# EAGLE design tophat (EAGLE 9.6.2)
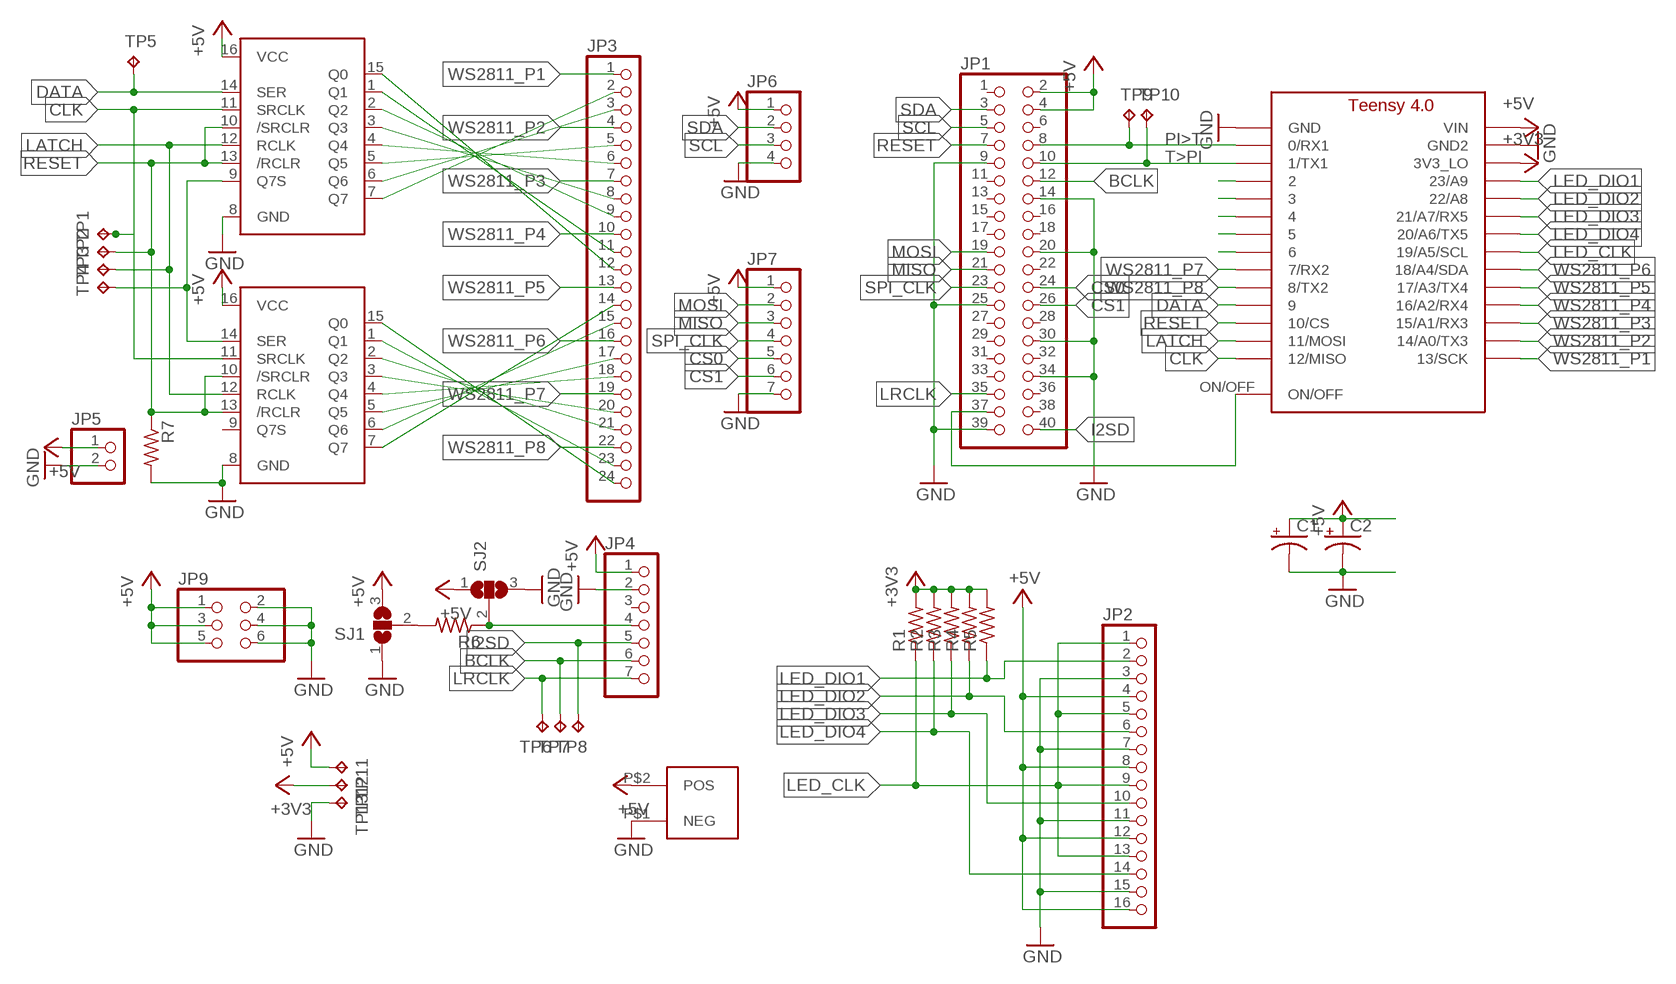
[diagram p0: schematic, sheet 1]

## Parts
C1  CPOL-USE5-10.5  [E5-10,5]
C2  CPOL-USE5-10.5  [E5-10,5]
JP1  PINHD-2X20  [2X20]
JP2  PINHD-1X16/90  [1X16/90]
JP3  PINHD-1X24/90  [1X24/90]
JP4  PINHD-1X7  [1X07]
JP5  PINHD-1X2  [1X02]
JP6  PINHD-1X4  [1X04]
JP7  PINHD-1X7  [1X07]
JP8  PWR_CONN  [PWR_CONN]
JP9  PINHD-2X3  [2X03]
R1  R-US_0207/10  [0207/10]
R2  R-US_0207/10  [0207/10]
R3  R-US_0207/10  [0207/10]
R4  R-US_0207/10  [0207/10]
R5  R-US_0207/10  [0207/10]
R6  R-US_0207/10  [0207/10]
R7  R-US_0207/10  [0207/10]
SJ1  SJ2W  [SJ_2]
SJ2  SJ2W  [SJ_2]
TP1  TPB2,54  [B2,54]
TP2  TPB2,54  [B2,54]
TP3  TPB2,54  [B2,54]
TP4  TPB2,54  [B2,54]
TP5  TPB2,54  [B2,54]
TP6  TPB2,54  [B2,54]
TP7  TPB2,54  [B2,54]
TP8  TPB2,54  [B2,54]
TP9  TPB2,54  [B2,54]
TP10  TPB2,54  [B2,54]
TP11  TPB2,54  [B2,54]
TP12  TPB2,54  [B2,54]
TP13  TPB2,54  [B2,54]
U$1  TEENSY_4.0  [TEENSY_4.0]
U$2  74AHCT95  [SOIC127P600X175-16N]
U$3  74AHCT95  [SOIC127P600X175-16N]

## Nets
+3V3: R1.2 R2.2 R3.2 R4.2 R5.2 TP12.TP U$1.3V3_LO
+5V: C1.+ C2.+ JP1.2 JP1.4 JP2.4 JP2.8 JP2.12 JP2.16 JP4.1 JP5.1 JP6.1 JP7.1 JP8.P$2(POS) JP9.1 JP9.3 JP9.5 SJ1.3 SJ2.1 TP11.TP U$1.VIN U$2.16(VCC) U$3.16(VCC)
BCLK: JP1.12 JP4.6 TP7.TP
CLK: TP1.TP U$1.12/MISO U$2.11(SRCLK) U$3.11(SRCLK)
CS0: JP1.24 JP7.5
CS1: JP1.26 JP7.6
DATA: TP5.TP U$1.9/CS U$2.14(SER)
GND: C1.- C2.- JP1.9 JP1.14 JP1.20 JP1.25 JP1.30 JP1.34 JP1.39 JP2.3 JP2.7 JP2.11 JP2.15 JP4.2 JP5.2 JP6.4 JP7.7 JP8.P$1(NEG) JP9.2 JP9.4 JP9.6 R7.2 SJ1.1 SJ2.3 TP13.TP U$1.GND U$1.GND2 U$2.8(GND) U$3.8(GND)
I2SD: JP1.40 JP4.5 TP8.TP
LATCH: TP3.TP U$1.11/MOSI U$2.12(RCLK) U$3.12(RCLK)
LED_CLK: JP2.1 JP2.5 JP2.9 JP2.13 R1.1 U$1.19/A5/SCL
LED_DIO1: JP2.2 R5.1 U$1.23/A9
LED_DIO2: JP2.6 R4.1 U$1.22/A8
LED_DIO3: JP2.10 R3.1 U$1.21/A7(21/A7/RX5)
LED_DIO4: JP2.14 R2.1 U$1.20/A6(20/A6/TX5)
LRCLK: JP1.35 JP4.7 TP6.TP
MISO: JP1.21 JP7.3
MOSI: JP1.19 JP7.2
N$1: TP4.TP U$2.9(Q7S) U$3.14(SER)
N$2: JP1.37 U$1.ON/OFF
N$4: JP3.2 U$2.7(Q7)
N$5: JP3.3 U$2.6(Q6)
N$6: JP3.5 U$2.5(Q5)
N$7: JP3.6 U$2.4(Q4)
N$8: JP3.8 U$2.3(Q3)
N$9: JP3.9 U$2.2(Q2)
N$10: JP3.11 U$2.1(Q1)
N$11: JP3.12 U$2.15(Q0)
N$12: JP3.14 U$3.7(Q7)
N$13: JP3.15 U$3.6(Q6)
N$14: JP3.17 U$3.5(Q5)
N$15: JP3.18 U$3.4(Q4)
N$16: JP3.20 U$3.3(Q3)
N$17: JP3.21 U$3.2(Q2)
N$18: JP3.23 U$3.1(Q1)
N$19: JP3.24 U$3.15(Q0)
N$20: JP4.4 R6.1 SJ2.2
N$21: R6.2 SJ1.2
N$28: U$1.6
N$29: U$1.5
N$30: U$1.4/CANRX
N$31: U$1.3/CANTX
N$32: U$1.2
PI>T: JP1.8 TP9.TP U$1.0/RX(0/RX1)
RESET: JP1.7 R7.1 TP2.TP U$1.10/CS U$2.10(/SRCLR) U$2.13(/RCLR) U$3.10(/SRCLR) U$3.13(/RCLR)
SCL: JP1.5 JP6.3
SDA: JP1.3 JP6.2
SPI_CLK: JP1.23 JP7.4
T>PI: JP1.10 TP10.TP U$1.1/TX(1/TX1)
WS2811_P1: JP3.1 U$1.13/SCK
WS2811_P2: JP3.4 U$1.14/A0(14/A0/TX3)
WS2811_P3: JP3.7 U$1.15/A1(15/A1/RX3)
WS2811_P4: JP3.10 U$1.16/A2(16/A2/RX4)
WS2811_P5: JP3.13 U$1.17/A3(17/A3/TX4)
WS2811_P6: JP3.16 U$1.18/A4/SDA
WS2811_P7: JP3.19 U$1.7(7/RX2)
WS2811_P8: JP3.22 U$1.8(8/TX2)
Unconnected: JP1.1 JP1.6 JP1.11 JP1.13 JP1.15 JP1.16 JP1.17 JP1.18 JP1.22 JP1.27 JP1.28 JP1.29 JP1.31 JP1.32 JP1.33 JP1.36 JP1.38 JP4.3 U$3.9(Q7S)

## Library data of the parts
C1 C2 = rcl:CPOL-US: POLARIZED CAPACITOR, American symbol; SPICEPREFIX: C
JP1 = pinhead:PINHD-2X20: PIN HEADER
JP2 = pinhead:PINHD-1X16: PIN HEADER
JP3 = pinhead:PINHD-1X24: PIN HEADER
JP4 JP7 = pinhead:PINHD-1X7: PIN HEADER
JP5 = pinhead:PINHD-1X2: PIN HEADER
JP6 = pinhead:PINHD-1X4: PIN HEADER
JP8 = railbaron:PWR_CONN
JP9 = pinhead:PINHD-2X3: PIN HEADER
R1-R7 = rcl:R-US_: RESISTOR, American symbol; SPICEPREFIX: R
SJ1 SJ2 = jumper:SJ2W: SMD solder JUMPER
TP1-TP13 = testpad:TP: Test pad
U$1 = railbaron:TEENSY_4.0
U$2 U$3 = railbaron:74AHCT95

## Board
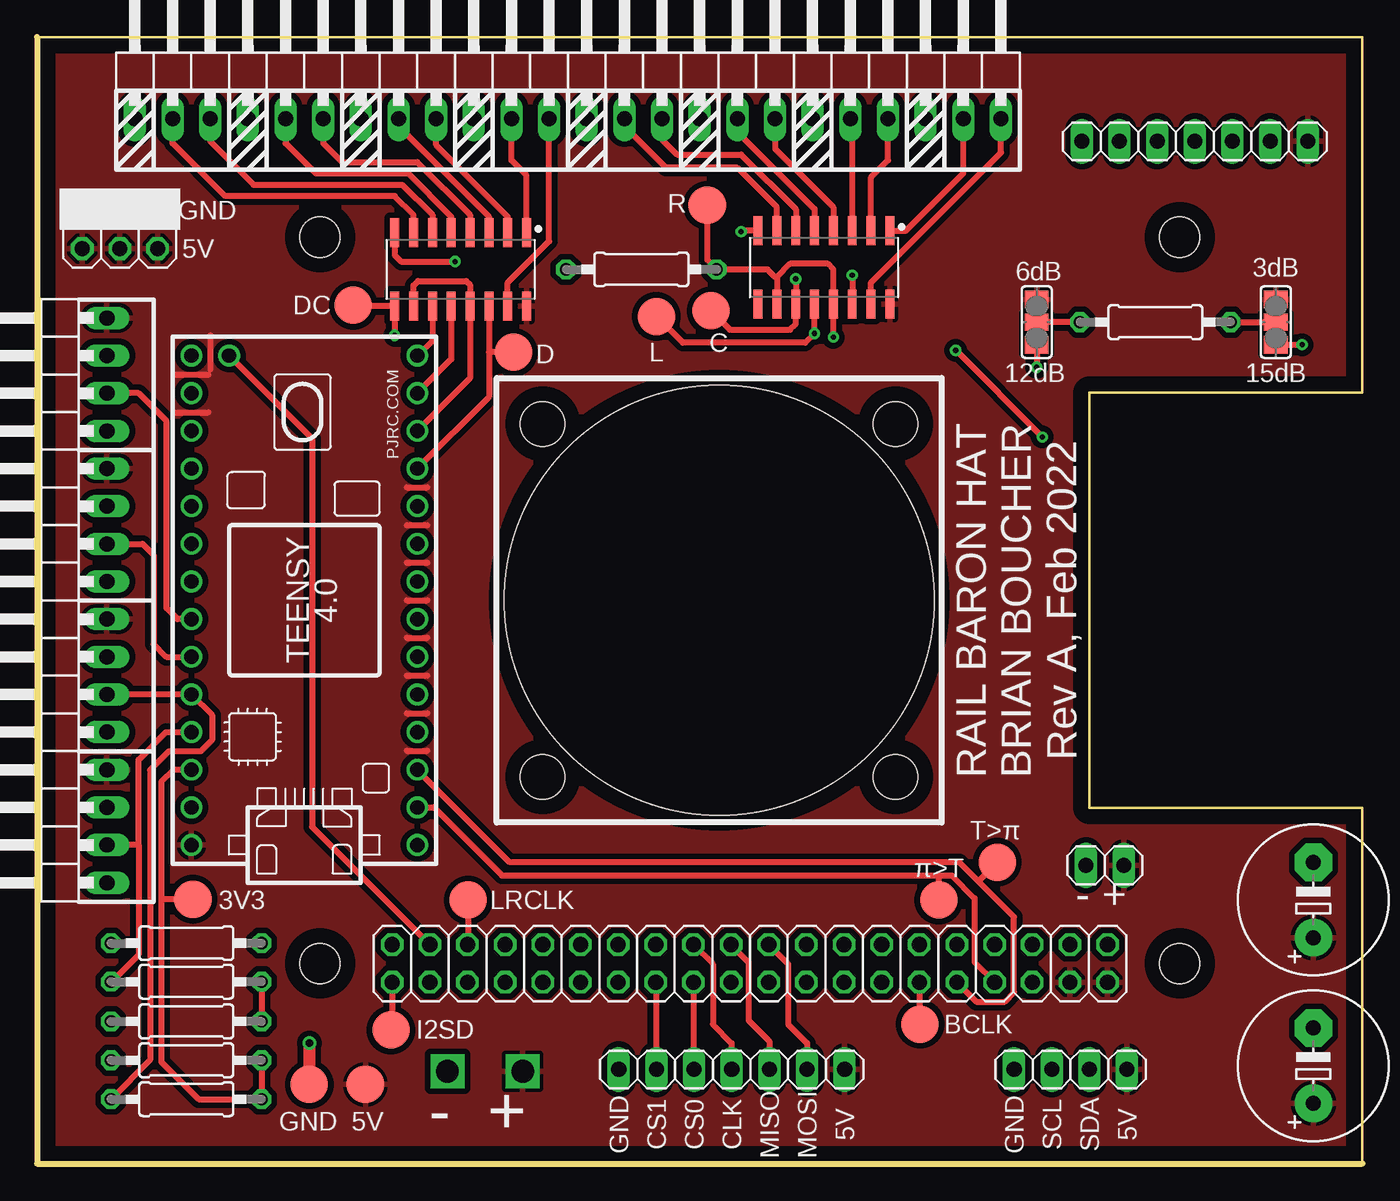
[diagram p1: board, top side]
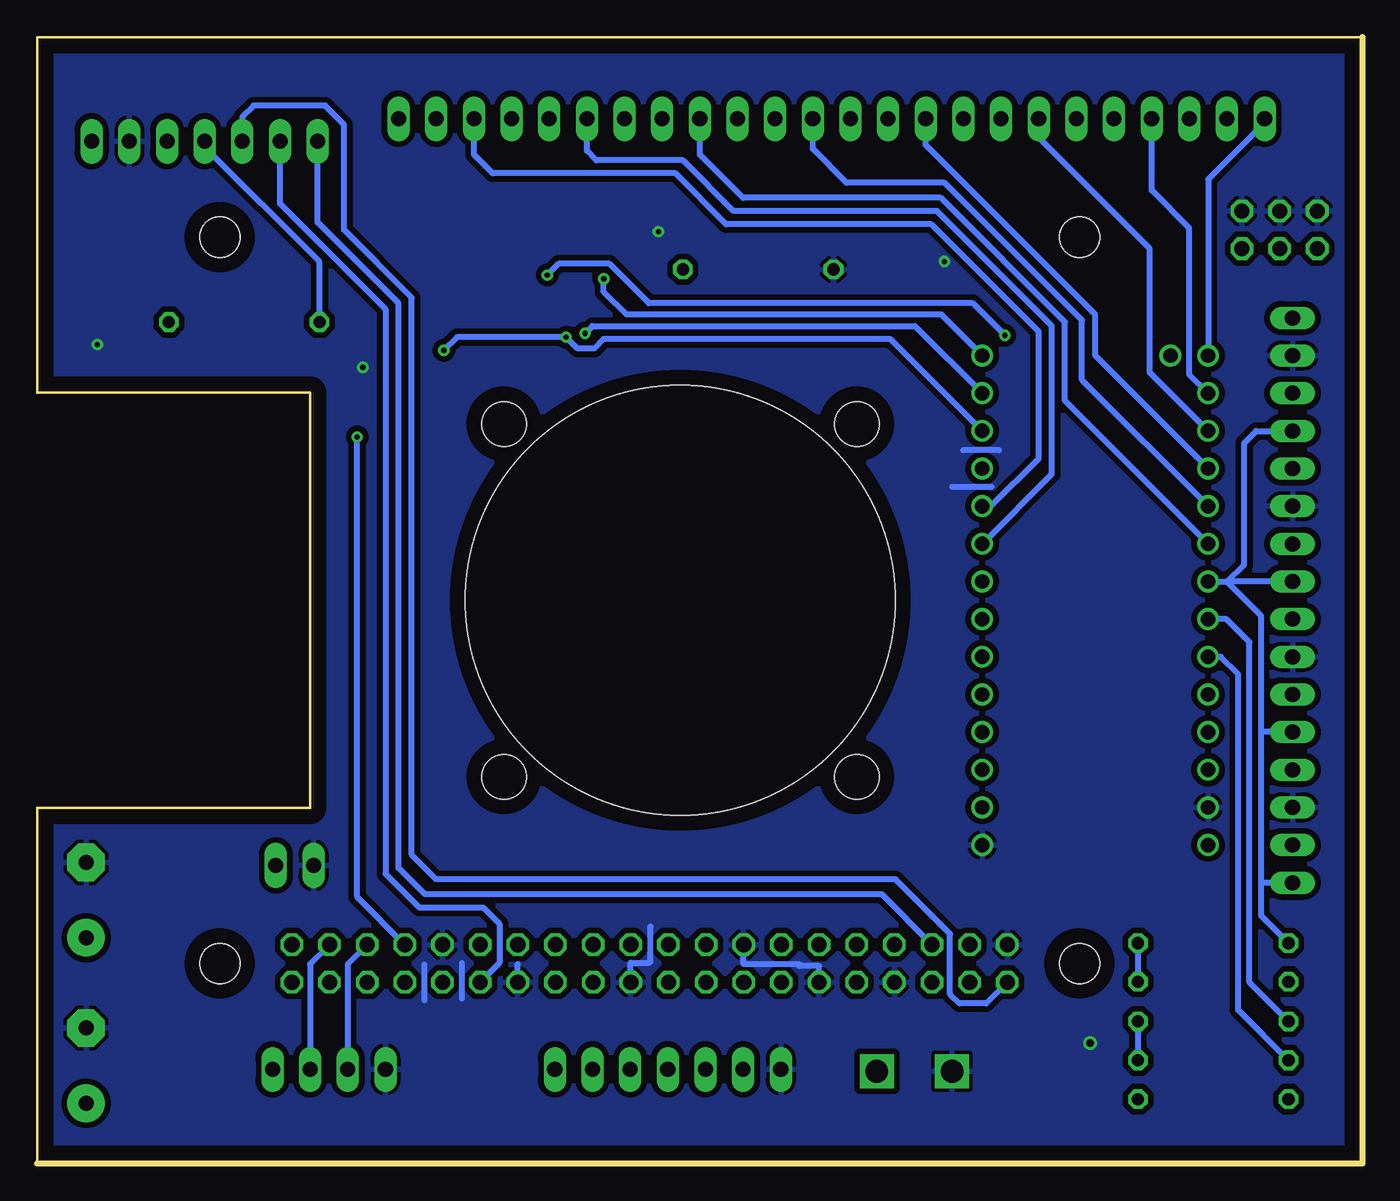
[diagram p2: board, bottom side, seen from below]

Size 89.41 x 76 mm. Coordinates in mm from the lower left corner, seen from the top.
Outline: 0,0 89.41,0 89.41,24 71,24 71,52 89.41,52 89.41,76 0,76 0,0
Copper layers (1*16): Top 0.035mm / dielectric 1.5mm / Bottom 0.035mm
Design rules "default *": minimum track width 6mil, minimum drill 0.35mm, track to track 6mil, track to pad 6mil, pad to pad 6mil, via to via 6mil, smd to smd 6mil, copper to edge 40mil, drill to drill 6mil, minimum pad ring 10mil, minimum via ring 8mil, stop-mask expansion 4mil, vias tented up to drill 20mil, thermal gap 10mil
Holes 2.7 mm at 19.09,13.5 77.09,13.5 77.09,62.5 19.09,62.5
Holes 3 mm at 34.12,26.1 57.92,26.1 57.92,49.9 34.12,49.9
Holes 29 mm at 46.02,38

### Footprints (pad centres in the part's own frame; a part is rotated, then mirrored left to right if it is on the bottom)
E5-10,5 = drill 1.016 pad 2.54: + -2.54,0 | drill 1.016 pad 2.54 octagon: - 2.54,0
2X20 = drill 1.016 octagon: 1 -24.13,-1.27; 2 -24.13,1.27; 3 -21.59,-1.27; 4 -21.59,1.27; 5 -19.05,-1.27; 6 -19.05,1.27; 7 -16.51,-1.27; 8 -16.51,1.27; 9 -13.97,-1.27; 10 -13.97,1.27; 11 -11.43,-1.27; 12 -11.43,1.27; 13 -8.89,-1.27; 14 -8.89,1.27; 15 -6.35,-1.27; 16 -6.35,1.27; 17 -3.81,-1.27; 18 -3.81,1.27; 19 -1.27,-1.27; 20 -1.27,1.27; 21 1.27,-1.27; 22 1.27,1.27; 23 3.81,-1.27; 24 3.81,1.27; 25 6.35,-1.27; 26 6.35,1.27; 27 8.89,-1.27; 28 8.89,1.27; 29 11.43,-1.27; 30 11.43,1.27; 31 13.97,-1.27; 32 13.97,1.27; 33 16.51,-1.27; 34 16.51,1.27; 35 19.05,-1.27; 36 19.05,1.27; 37 21.59,-1.27; 38 21.59,1.27; 39 24.13,-1.27; 40 24.13,1.27
1X16/90 = drill 1.016 long: 1 -19.05,-3.81; 2 -16.51,-3.81; 3 -13.97,-3.81; 4 -11.43,-3.81; 5 -8.89,-3.81; 6 -6.35,-3.81; 7 -3.81,-3.81; 8 -1.27,-3.81; 9 1.27,-3.81; 10 3.81,-3.81; 11 6.35,-3.81; 12 8.89,-3.81; 13 11.43,-3.81; 14 13.97,-3.81; 15 16.51,-3.81; 16 19.05,-3.81
1X24/90 = drill 1.016 long: 1 -29.21,-3.81; 2 -26.67,-3.81; 3 -24.13,-3.81; 4 -21.59,-3.81; 5 -19.05,-3.81; 6 -16.51,-3.81; 7 -13.97,-3.81; 8 -11.43,-3.81; 9 -8.89,-3.81; 10 -6.35,-3.81; 11 -3.81,-3.81; 12 -1.27,-3.81; 13 1.27,-3.81; 14 3.81,-3.81; 15 6.35,-3.81; 16 8.89,-3.81; 17 11.43,-3.81; 18 13.97,-3.81; 19 16.51,-3.81; 20 19.05,-3.81; 21 21.59,-3.81; 22 24.13,-3.81; 23 26.67,-3.81; 24 29.21,-3.81
1X07 = drill 1.016 long: 1 -7.62,0; 2 -5.08,0; 3 -2.54,0; 4 0,0; 5 2.54,0; 6 5.08,0; 7 7.62,0
1X02 = drill 1.016 long: 1 -1.27,0; 2 1.27,0
1X04 = drill 1.016 long: 1 -3.81,0; 2 -1.27,0; 3 1.27,0; 4 3.81,0
PWR_CONN = drill 1.524 square: P$1 -2.54,0; P$2 2.54,0
2X03 = drill 1.016 octagon: 1 -2.54,-1.27; 2 -2.54,1.27; 3 0,-1.27; 4 0,1.27; 5 2.54,-1.27; 6 2.54,1.27
0207/10 = drill 0.813 octagon: 1 -5.08,0; 2 5.08,0
SJ_2 = smd 1.168 x 1.6: 1 -1.524,0; 2 0,0; 3 1.524,0
B2,54 = smd 2.54 x 2.54: TP 0,0
TEENSY_4.0 = drill 0.965: 0/RX -13.97,-7.62; 1/TX -11.43,-7.62; 2 -8.89,-7.62; 3/CANTX -6.35,-7.62; 3V3_LO -11.43,7.62; 4/CANRX -3.81,-7.62; 5 -1.27,-7.62; 6 1.27,-7.62; 7 3.81,-7.62; 8 6.35,-7.62; 9/CS 8.89,-7.62; 10/CS 11.43,-7.62; 11/MOSI 13.97,-7.62; 12/MISO 16.51,-7.62; 13/SCK 16.51,7.62; 14/A0 13.97,7.62; 15/A1 11.43,7.62; 16/A2 8.89,7.62; 17/A3 6.35,7.62; 18/A4/SDA 3.81,7.62; 19/A5/SCL 1.27,7.62; 20/A6 -1.27,7.62; 21/A7 -3.81,7.62; 22/A8 -6.35,7.62; 23/A9 -8.89,7.62; GND -16.51,-7.62; GND2 -13.97,7.62; ON/OFF 16.51,5.08; VIN -16.51,7.62
SOIC127P600X175-16N = smd 1.965 x 0.602: 1 -2.475,4.445; 2 -2.475,3.175; 3 -2.475,1.905; 4 -2.475,0.635; 5 -2.475,-0.635; 6 -2.475,-1.905; 7 -2.475,-3.175; 8 -2.475,-4.445; 9 2.475,-4.445; 10 2.475,-3.175; 11 2.475,-1.905; 12 2.475,-0.635; 13 2.475,0.635; 14 2.475,1.905; 15 2.475,3.175; 16 2.475,4.445

### Placement (x,y rotation side)
C1  86.11,17.78 90 top
C2  86.11,6.6 90 top
JP1  48.09,13.5 180 top
JP2  0.91,38 90 top
JP3  35.81,74.3 0 top
JP4  78.11,68.96 180 top
JP5  72.03,20.12 180 top
JP6  69.72,6.35 180 top
JP7  46.86,6.35 180 top
JP8  30.23,6.22 0 top
JP9  5.59,62.99 0 top
R1  10.07,14.87 0 top
R2  10.07,9.59 0 top
R3  10.07,6.97 0 top
R4  10.07,4.35 0 top
R5  10.07,12.27 0 top
R6  75.44,56.77 0 top
R7  40.77,60.33 180 top
SJ1  83.57,56.77 90 top
SJ2  67.44,56.77 270 top
TP1  45.47,57.53 0 top
TP2  45.21,64.64 0 top
TP3  41.78,57.15 0 top
TP4  21.34,57.91 0 top
TP5  32.13,54.74 0 top
TP6  29.08,17.78 0 top
TP7  59.56,9.4 0 top
TP8  23.88,9.02 0 top
TP9  60.83,17.78 0 top
TP10  64.77,20.32 0 top
TP11  22.15,5.33 0 top
TP12  10.52,17.83 0 top
TP13  18.36,5.33 0 top
U$1  18.03,38 90 top
U$2  28.57,60.33 270 top
U$3  53.09,60.45 270 top

### Tracks (layer width: path | path; a pad name or v marks a point on that pad's centre or on a via)
+3V3
  Top 0.406: U$1.3V3_LO 9.17,26.57 8.38,25.78 8.38,17.83 | R5.2 R2.2 | R3.2 R4.2 10.89,4.35 8.38,6.86 8.38,17.83 | TP12.TP 8.38,17.83
  Bottom 0.406: R1.2 R5.2 | R2.2 R3.2
+5V
  Top 0.406: 24.94,45.62 26.31,45.62 | 24.94,43.08 26.31,43.08 | 24.94,40.54 26.31,40.54 | 24.94,38 26.31,38 | 24.94,35.46 26.31,35.46 | 24.94,32.92 26.31,32.92 | 24.94,30.38 26.31,30.38 | 24.94,27.84 26.31,27.84 | 11.68,55.88 11.68,53.59 | 9.27,53.21 11.56,53.21 | 9.27,50.67 11.56,50.67
  pour Top (isolate 0.381): -5,76 89.41,76 89.41,0 -5,0
BCLK
  Top 0.406: JP1.12 59.52,9.44 TP7.TP
  Bottom 0.406: JP4.6 73.03,64.77 65.91,57.66 65.91,19.56 63.63,17.27 59.31,17.27 58.22,16.18 58.22,13.53 JP1.12
CLK  (via drill 0.35)
  Top 0.406: U$2.11 26.67,55.53 U$1.12/MISO | v51.18,59.69 U$3.11 51.18,56.64 50.8,56.26 46.74,56.26 TP1.TP
  Bottom 0.406: U$1.12/MISO 28.42,57.28 49.66,57.28 51.18,58.8 v51.18,59.69
CS0
  Top 0.406: JP1.24 44.28,6.39 JP7.5
CS1
  Top 0.406: JP1.26 41.74,6.39 JP7.6
DATA
  Top 0.406: U$2.14 30.48,54.74 | 30.48,54.74 30.48,51.72 U$1.9/CS | TP5.TP 30.48,54.74
GND  (via drill 0.35, 0.5)
  Top 0.406: U$3.8 47.56,62.93 v47.5,62.87 | U$2.8 24.13,61.28 24.55,60.86 v28.19,60.86 | SJ1.1 v85.34,55.24 | SJ2.3 v67.44,53.72
  Top 0.813: v18.36,8.13 TP13.TP
  Bottom 0.406: JP1.30 36.66,13.34 37.98,13.34 37.98,13.45 41.74,13.45 JP1.25 | JP1.20 49.36,13.55 48.14,13.55 48.14,13.59 48.04,13.59 48.04,15.99 48.01,15.99 48.01,16 | JP1.14 56.98,13.46 | 24.51,48.13 26.92,48.13 | 25.02,45.64 27.69,45.64 | 60.76,13.51 60.76,11.12 | 63.3,13.41 63.3,11.02
  pour Bottom (isolate 0.381): -5,76 89.41,76 89.41,0 -5,0
I2SD
  Top 0.406: JP1.40 23.96,9.1 TP8.TP
  Bottom 0.406: JP1.40 25.4,10.79 27.18,10.79 27.81,11.43 27.81,15.49 31.5,19.18 62.48,19.18 64.14,20.83 64.14,58.42 68.71,62.99 68.71,70.1 69.98,71.37 74.8,71.37 75.56,70.61 JP4.5
LATCH  (via drill 0.35)
  Top 0.406: U$2.12 27.94,54.26 U$1.11/MOSI | U$3.12 v52.45,56.01 51.82,55.37 43.56,55.37 TP3.TP
  Bottom 0.406: U$1.11/MOSI 30.2,56.52 51.94,56.52 v52.45,56.01
LED_CLK
  Bottom 0.406: 9.1,39.27 U$1.19/A5/SCL 9.15,39.27 6.85,36.97 6.85,29.11 | 9.1,39.27 7.99,40.39 7.99,48.61 7.16,49.43 JP2.13 | 6.85,29.11 6.85,18.9 | 6.85,18.9 6.85,16.76 4.99,14.89 R1.1 | JP2.9 9.1,39.27 | JP2.5 6.85,29.11 | JP2.1 6.8,18.95 6.85,18.9
LED_DIO1
  Top 0.406: U$1.23/A9 8.71,29.11 6.84,27.24 6.84,21.54 | R5.1 5.03,12.27 6.84,14.08 6.84,21.54 | JP2.2 4.76,21.54 6.84,21.54
LED_DIO2
  Top 0.406: R4.1 7.62,6.99 7.62,26.54 8.89,27.81 11.05,27.81 11.81,28.57 11.81,30.25 U$1.22/A8 JP2.6
LED_DIO3
  Top 0.406: U$1.21/A7 8.72,34.19 7.86,35.05 7.86,41.06 7.11,41.81 JP2.10
  Bottom 0.406: R3.1 8.38,10.36 8.38,33.02 9.55,34.19 U$1.21/A7
LED_DIO4
  Top 0.406: U$1.20/A6 9.48,36.73 8.74,37.47 8.74,50.09 6.86,51.97 JP2.14
  Bottom 0.406: R2.1 7.62,12.22 7.62,35.18 9.17,36.73 U$1.20/A6
LRCLK
  Top 0.406: TP6.TP 29.08,14.81 JP1.35
  Bottom 0.406: JP1.35 32.43,18.16 63.25,18.16 65.02,19.94 65.02,58.04 70.48,63.5 JP4.7
MISO
  Top 0.406: JP1.21 48.01,13.58 48.01,9.65 49.4,8.26 JP7.3
MOSI
  Top 0.406: JP1.19 50.67,13.46 50.67,9.4 51.94,8.13 JP7.2
N$1  (via drill 0.35)
  Top 0.406: v24.13,55.88 U$2.9 21.4,57.85 TP4.TP | v54.99,59.94 U$3.14
  Bottom 0.406: v24.13,55.88 26.29,58.04 48.13,58.04 50.8,60.71 54.23,60.71 v54.99,59.94
N$2
  Top 0.406: U$1.ON/OFF 18.54,48.92 18.54,22.73 JP1.37
N$4
  Top 0.406: U$2.7 25.4,64.01 24.13,65.28 12.7,65.28 9.14,68.83 JP3.2
N$5
  Top 0.406: JP3.3 11.68,68.96 14.61,66.04 24.64,66.04 26.67,64.01 U$2.6
N$6
  Top 0.406: JP3.5 16.76,68.83 18.8,66.8 25.02,66.8 27.94,63.88 U$2.5
N$7
  Top 0.406: JP3.6 19.3,68.83 20.57,67.56 25.65,67.56 29.21,64.01 U$2.4
N$8
  Top 0.406: JP3.8 24.38,69.98 30.48,63.88 U$2.3
N$9
  Top 0.406: U$2.2 31.75,63.88 26.92,68.71 JP3.9
N$10
  Top 0.406: U$2.1 33.02,66.67 32,67.69 JP3.11
N$11
  Top 0.406: U$2.15 31.75,59.44 34.54,62.23 JP3.12
N$12
  Top 0.406: U$3.7 49.91,64.52 47.24,67.18 42.42,67.18 39.62,69.98 JP3.14
N$13
  Top 0.406: JP3.15 42.16,69.09 43.18,68.07 47.5,68.07 51.18,64.39 U$3.6
N$14
  Top 0.406: JP3.17 47.24,69.6 52.45,64.39 U$3.5
N$15
  Top 0.406: JP3.18 49.78,68.45 53.72,64.52 U$3.4
N$16
  Top 0.406: U$3.3 54.99,70.36 JP3.20
N$17
  Top 0.406: U$3.2 56.26,66.55 57.4,67.69 JP3.21
N$18
  Top 0.406: JP3.23 62.48,66.8 58.61,62.93 U$3.1
N$19
  Top 0.406: U$3.15 56.26,59.44 65.02,68.2 JP3.24
N$20
  Top 0.406: R6.1 SJ2.2
  Bottom 0.406: R6.1 70.36,60.83 78.11,68.58 JP4.4
N$21
  Top 0.406: R6.2 SJ1.2
PI>T
  Top 0.406: U$1.0/RX 26.77,24.03 31.37,19.43 60.83,19.43 | 60.83,19.43 61.72,19.43 63.25,17.91 63.25,13.58 JP1.8 | TP9.TP 60.83,19.43
RESET  (via drill 0.35)
  Top 0.406: U$1.10/CS 29.21,52.99 U$2.13 29.21,59.28 28.96,59.54 25.7,59.54 25.4,59.23 U$2.10 | 49.91,59.82 50.8,60.71 53.34,60.71 53.72,60.33 U$3.13 v53.72,55.75 | 49.91,59.82 U$3.10 | 49.91,59.82 49.78,59.82 49.28,60.33 R7.1 45.21,60.96 TP2.TP | v61.98,54.86 v67.82,49.02
  Bottom 0.406: U$1.10/CS 31.85,55.63 51.18,55.63 51.82,54.99 52.96,54.99 v53.72,55.75 61.09,55.75 v61.98,54.86 | JP1.7 67.82,17.99 v67.82,49.02
SCL
  Bottom 0.406: JP1.5 68.45,13.46 JP6.3
SDA
  Bottom 0.406: JP1.3 70.99,13.46 JP6.2
SPI_CLK
  Top 0.406: JP1.23 45.59,13.46 45.59,9.4 46.86,8.13 JP7.4
T>PI
  Top 0.406: JP1.10 63.37,10.92 65.28,10.92 65.91,11.56 65.91,16.64 63.5,19.05 | 63.5,19.05 62.23,20.32 31.88,20.32 25.65,26.55 U$1.1/TX | TP10.TP 63.5,19.05
WS2811_P1
  Bottom 0.406: JP3.1 6.6,70.21 10.41,66.4 U$1.13/SCK
WS2811_P2
  Bottom 0.406: U$1.14/A0 11.68,53.24 11.68,63.12 14.22,65.66 JP3.4
WS2811_P3
  Bottom 0.406: U$1.15/A1 14.35,53.37 14.35,61.72 21.84,69.22 JP3.7
WS2811_P4
  Bottom 0.406: U$1.16/A2 18.03,54.51 18.03,57.28 29.46,68.71 JP3.10
WS2811_P5
  Bottom 0.406: U$1.17/A3 18.92,52.86 18.92,56.9 28.19,66.17 34.8,66.17 37.08,68.45 JP3.13
WS2811_P6
  Bottom 0.406: U$1.18/A4/SDA 20.07,51.46 20.07,56.77 28.45,65.15 41.78,65.15 44.7,68.07 JP3.16
WS2811_P7
  Bottom 0.406: JP3.19 52.32,68.33 51.69,67.69 45.85,67.69 42.42,64.26 28.7,64.26 20.95,56.52 20.95,46.51 U$1.7 | U$1.7
WS2811_P8
  Bottom 0.406: U$1.8 25.07,44.35 21.84,47.57 21.84,56.13 29.08,63.37 42.93,63.37 46.35,66.8 58.67,66.8 59.94,68.07 JP3.22

### Text on the board
tNames: R | GND | 5V | 6dB | 3dB | DC | D | L | C | 12dB | 15dB | RAIL BARON HAT / BRIAN BOUCHER / Rev A, Feb 2022 | T>π | π>T | 3V3 | LRCLK | - + | I2SD | BCLK | GND | 5V | GND | CS1 | CS0 | CLK | MISO | MOSI | 5V | GND | SCL | SDA | 5V | - +